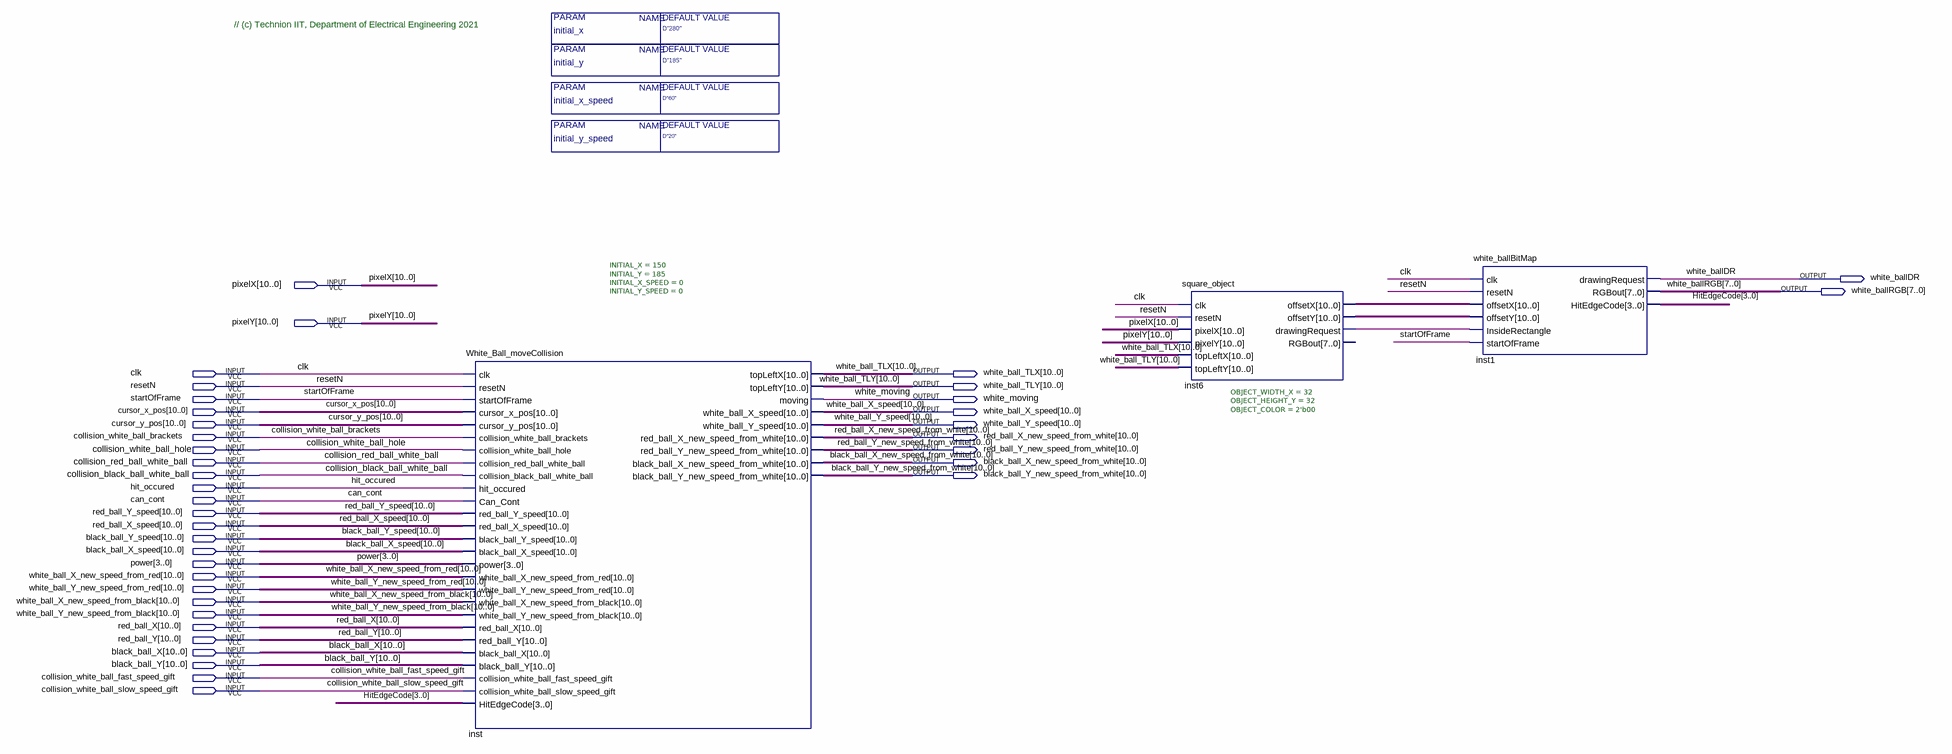
[diagram p0: schematic sheet]
// Quartus schematic White_ball_block.bdf as structural Verilog: 3 symbols, 39 pins
module White_ball_block #(parameter initial_x = "D\"280\"", parameter initial_y = "D\"185\"", parameter initial_x_speed = "D\"60\"", parameter initial_y_speed = "D\"20\"") (
  input  [10:0] pixelX,
  input  [10:0] pixelY,
  input  clk,
  input  resetN,
  input  startOfFrame,
  input  [10:0] cursor_x_pos,
  input  [10:0] cursor_y_pos,
  input  collision_white_ball_brackets,
  input  collision_white_ball_hole,
  input  collision_red_ball_white_ball,
  input  collision_black_ball_white_ball,
  input  hit_occured,
  input  can_cont,
  input  [10:0] red_ball_Y_speed,
  input  [10:0] red_ball_X_speed,
  input  [10:0] black_ball_Y_speed,
  input  [10:0] black_ball_X_speed,
  input  [3:0] power,
  input  [10:0] white_ball_X_new_speed_from_red,
  input  [10:0] white_ball_Y_new_speed_from_red,
  input  [10:0] white_ball_X_new_speed_from_black,
  input  [10:0] white_ball_Y_new_speed_from_black,
  input  [10:0] red_ball_X,
  input  [10:0] red_ball_Y,
  input  [10:0] black_ball_X,
  input  [10:0] black_ball_Y,
  input  collision_white_ball_fast_speed_gift,
  input  collision_white_ball_slow_speed_gift,
  output white_ballDR,
  output [7:0] white_ballRGB,
  output [10:0] white_ball_TLX,
  output [10:0] white_ball_TLY,
  output white_moving,
  output [10:0] white_ball_X_speed,
  output [10:0] white_ball_Y_speed,
  output [10:0] red_ball_X_new_speed_from_white,
  output [10:0] red_ball_Y_new_speed_from_white,
  output [10:0] black_ball_X_new_speed_from_white,
  output [10:0] black_ball_Y_new_speed_from_white
);

  wire inst6_drawingrequest;
  wire [3:0] HitEdgeCode;
  wire [10:0] inst6_offsetx, inst6_offsety;

  White_Ball_moveCollision #(.INITIAL_X(150), .INITIAL_Y(185), .INITIAL_X_SPEED(0), .INITIAL_Y_SPEED(0)) inst (
    .clk(clk), .resetN(resetN), .startOfFrame(startOfFrame), .cursor_x_pos(cursor_x_pos),
    .cursor_y_pos(cursor_y_pos), .collision_white_ball_brackets(collision_white_ball_brackets),
    .collision_white_ball_hole(collision_white_ball_hole),
    .collision_red_ball_white_ball(collision_red_ball_white_ball),
    .collision_black_ball_white_ball(collision_black_ball_white_ball), .hit_occured(hit_occured),
    .Can_Cont(can_cont), .red_ball_Y_speed(red_ball_Y_speed), .red_ball_X_speed(red_ball_X_speed),
    .black_ball_Y_speed(black_ball_Y_speed), .black_ball_X_speed(black_ball_X_speed), .power(power),
    .white_ball_X_new_speed_from_red(white_ball_X_new_speed_from_red),
    .white_ball_Y_new_speed_from_red(white_ball_Y_new_speed_from_red),
    .white_ball_X_new_speed_from_black(white_ball_X_new_speed_from_black),
    .white_ball_Y_new_speed_from_black(white_ball_Y_new_speed_from_black), .red_ball_X(red_ball_X),
    .red_ball_Y(red_ball_Y), .black_ball_X(black_ball_X), .black_ball_Y(black_ball_Y),
    .collision_white_ball_fast_speed_gift(collision_white_ball_fast_speed_gift),
    .collision_white_ball_slow_speed_gift(collision_white_ball_slow_speed_gift), .HitEdgeCode(HitEdgeCode),
    .topLeftX(white_ball_TLX), .topLeftY(white_ball_TLY), .moving(white_moving),
    .white_ball_X_speed(white_ball_X_speed), .white_ball_Y_speed(white_ball_Y_speed),
    .red_ball_X_new_speed_from_white(red_ball_X_new_speed_from_white),
    .red_ball_Y_new_speed_from_white(red_ball_Y_new_speed_from_white),
    .black_ball_X_new_speed_from_white(black_ball_X_new_speed_from_white),
    .black_ball_Y_new_speed_from_white(black_ball_Y_new_speed_from_white));
  square_object #(.OBJECT_WIDTH_X(32), .OBJECT_HEIGHT_Y(32), .OBJECT_COLOR(2'b00)) inst6 (
    .clk(clk), .resetN(resetN), .pixelX(pixelX), .pixelY(pixelY), .topLeftX(white_ball_TLX),
    .topLeftY(white_ball_TLY), .offsetX(inst6_offsetx), .offsetY(inst6_offsety),
    .drawingRequest(inst6_drawingrequest));  // open: RGBout
  white_ballBitMap inst1 (
    .clk(clk), .resetN(resetN), .offsetX(inst6_offsetx), .offsetY(inst6_offsety),
    .InsideRectangle(inst6_drawingrequest), .startOfFrame(startOfFrame), .drawingRequest(white_ballDR),
    .RGBout(white_ballRGB), .HitEdgeCode(HitEdgeCode));

  // Notes on the sheet:
  //   // (c) Technion IIT, Department of Electrical Engineering 2021
endmodule
